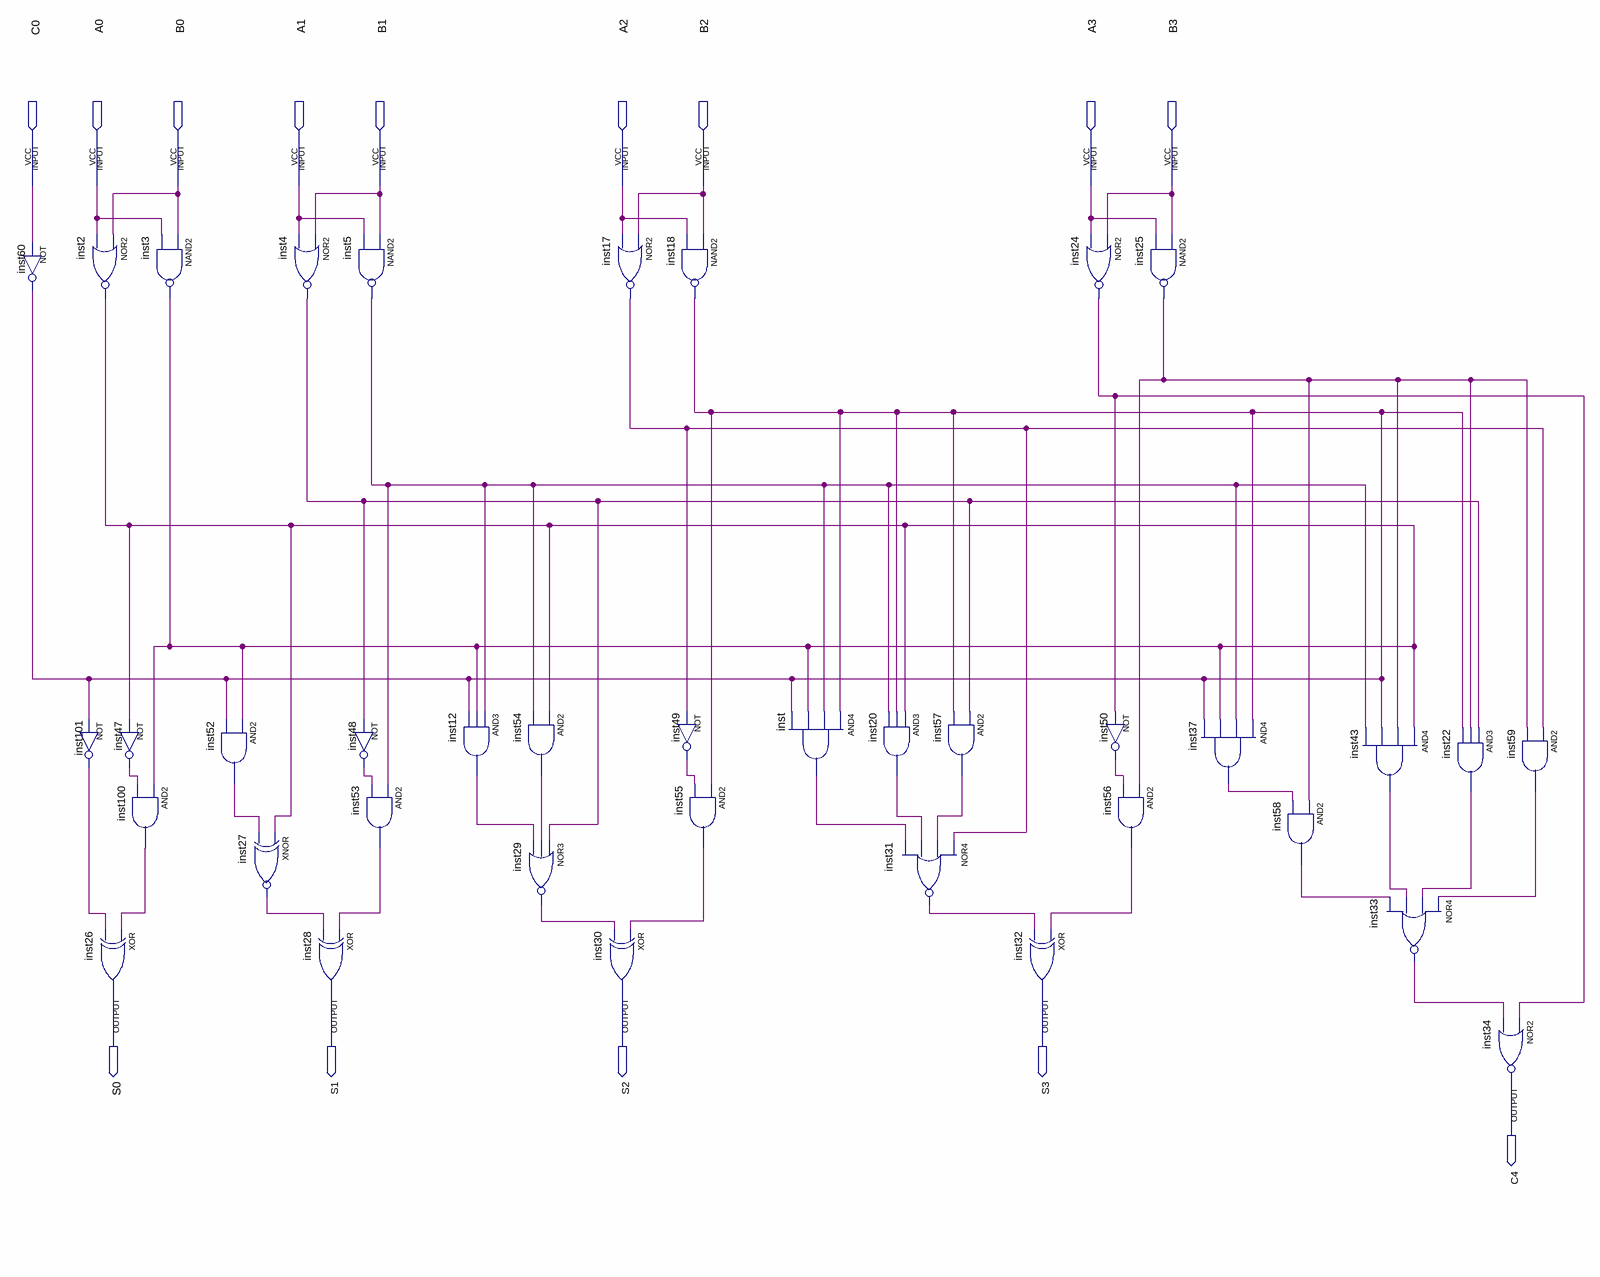
[diagram p0: schematic sheet]
// Quartus schematic CI7483.bdf as structural Verilog: 38 symbols, 14 pins
module CI7483 (
  input  C0,
  input  A0,
  input  B0,
  input  A1,
  input  B1,
  input  A2,
  input  B2,
  input  A3,
  input  B3,
  output S0,
  output S1,
  output S2,
  output S3,
  output C4
);

  wire inst2_out, inst4_out, inst5_out, inst12_out, inst17_out, inst20_out, inst22_out, inst24_out,
       inst25_out, inst27_out, inst29_out, inst31_out, inst33_out, inst37_out, inst43_out, inst47_out,
       inst48_out, inst49_out, inst50_out, inst52_out, inst53_out, inst54_out, inst55_out, inst56_out,
       inst57_out, inst58_out, inst59_out, inst60_out, inst100_out, inst101_out, inst_out;

  not inst60 (inst60_out, C0);
  nor inst2 (inst2_out, B0, A0);
  not inst101 (inst101_out, inst60_out);
  nand inst3 (inst2_out, B0, A0);
  not inst47 (inst47_out, inst2_out);
  and inst100 (inst100_out, inst2_out, inst47_out);
  xor inst26 (S0, inst100_out, inst101_out);
  and inst52 (inst52_out, inst2_out, inst60_out);
  xnor inst27 (inst27_out, inst2_out, inst52_out);
  nor inst4 (inst4_out, B1, A1);
  xor inst28 (S1, inst53_out, inst27_out);
  nand inst5 (inst5_out, B1, A1);
  not inst48 (inst48_out, inst4_out);
  and inst53 (inst53_out, inst5_out, inst48_out);
  and inst12 (inst12_out, inst5_out, inst2_out, inst60_out);
  and inst54 (inst54_out, inst2_out, inst5_out);
  nor inst29 (inst29_out, inst4_out, inst54_out, inst12_out);
  xor inst30 (S2, inst55_out, inst29_out);
  nor inst17 (inst17_out, B2, A2);
  nand inst18 (inst60_out, B2, A2);
  not inst49 (inst49_out, inst17_out);
  and inst55 (inst55_out, inst60_out, inst49_out);
  and inst (inst_out, inst60_out, inst5_out, inst2_out, inst60_out);
  and inst20 (inst20_out, inst2_out, inst60_out, inst5_out);
  nor inst31 (inst31_out, inst17_out, inst57_out, inst20_out, inst_out);
  and inst57 (inst57_out, inst4_out, inst60_out);
  xor inst32 (S3, inst56_out, inst31_out);
  nor inst24 (inst24_out, B3, A3);
  not inst50 (inst50_out, inst24_out);
  and inst56 (inst56_out, inst25_out, inst50_out);
  nand inst25 (inst25_out, B3, A3);
  and inst37 (inst37_out, inst60_out, inst5_out, inst2_out, inst60_out);
  and inst58 (inst58_out, inst25_out, inst37_out);
  and inst43 (inst43_out, inst2_out, inst25_out, inst60_out, inst5_out);
  nor inst33 (inst33_out, inst59_out, inst22_out, inst43_out, inst58_out);
  and inst22 (inst22_out, inst4_out, inst25_out, inst60_out);
  nor inst34 (C4, inst24_out, inst33_out);
  and inst59 (inst59_out, inst17_out, inst25_out);
endmodule
